# EAGLE design WireToSocket (EAGLE 7.4.0)
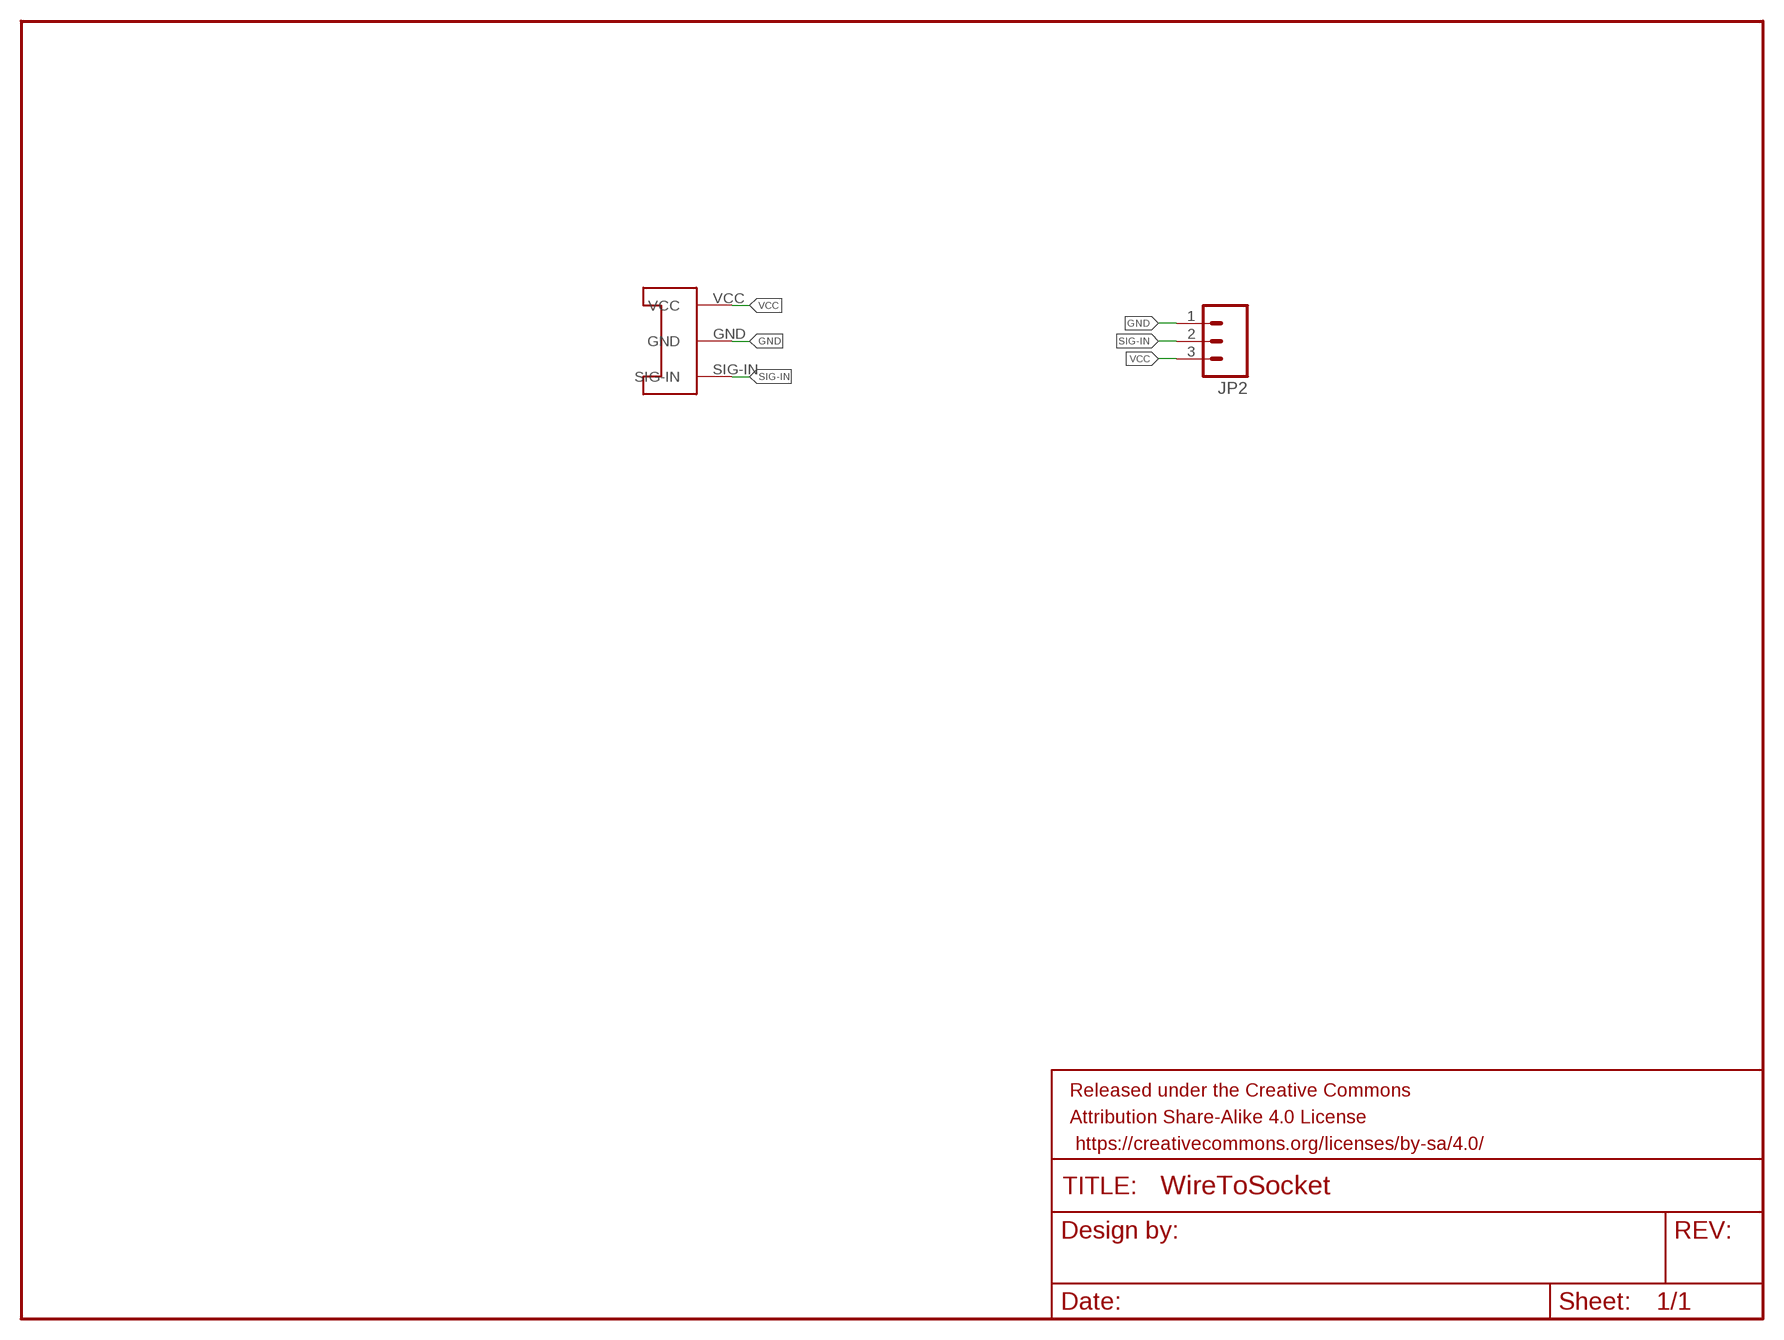
[diagram p0: schematic, sheet 1]

## Parts
FRAME1  FRAME-LETTERNO_PACKAGE  [DUMMY]
JP2  M03SMD  [1X03-1MM-RA]
U$1  CONN-SOCKET-3POS-3MM  [SOCKET-3POS-3MM-SMD]

## Nets
GND: JP2.1 U$1.GND
SIG-IN: JP2.2 U$1.SIG-IN
VCC: JP2.3 U$1.VCC

## Library data of the parts
FRAME1 = SparkFun-Aesthetics:FRAME-LETTER: Schematic Frame Standard 8.5x11 US Letter frame; DESIGNER: Nobody; VERSION: v01
JP2 = SparkFun-Connectors:M03: Header 3 Standard 3-pin 0.1" header. Use with straight break away headers (SKU : PRT-00116), right angle break away headers (PRT-00553), swiss pins (PRT-00743), machine pins (PRT-00117), and female headers (PRT-00115). Molex polarized connector foot print use with SKU : PRT-08232 with associated crimp pins and housings.
U$1 = EmbeddedPlayground:CONN-SOCKET-3POS-3MM: Surface mount board to board connector. Female socket, 3 position.

## Board
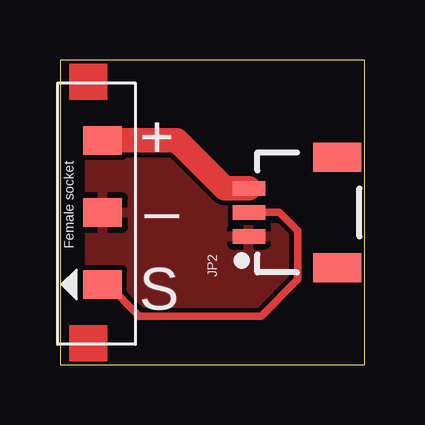
[diagram p1: board, top side]
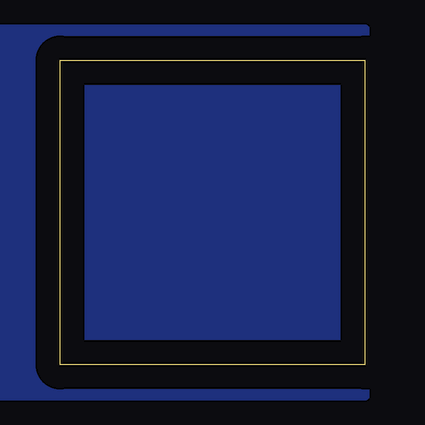
[diagram p2: board, bottom side, seen from below]

Size 12.7 x 12.7 mm. Coordinates in mm from the lower left corner, seen from the top.
Outline: 0,0 12.7,0 12.7,12.7 0,12.7 0,0
Copper layers (1*16): Top 0.035mm / dielectric 1.5mm / Bottom 0.035mm
Design rules "default": minimum track width 10mil, minimum drill 24mil, track to track 8mil, track to pad 8mil, pad to pad 8mil, via to via 8mil, smd to smd 8mil, copper to edge 40mil, drill to drill 8mil, minimum pad ring 10mil, minimum via ring 8mil, stop-mask expansion 4mil, vias tented up to drill 0mil, thermal gap 10mil

### Footprints (pad centres in the part's own frame; a part is rotated, then mirrored left to right if it is on the bottom)
1X03-1MM-RA = smd 0.6 x 1.35: 1 -1,0; 2 0,0; 3 1,0 | smd 1.2 x 2: NC1 2.3,-3.675; NC2 -2.3,-3.675
SOCKET-3POS-3MM-SMD = smd 1.2 x 1.6: GND 0,0; SIG-IN -3,0; VCC 3,0

### Placement (x,y rotation side)
FRAME1  0,0 0 top
JP2  7.87,6.35 90 top
U$1  1.78,6.35 90 top

### Tracks (layer width: path | path; a pad name or v marks a point on that pad's centre or on a via)
GND
  pour Top: 0,13.97 0,-1.27 15.24,-1.27 15.24,13.97
  pour Bottom: 0,13.97 15.24,13.97 15.24,-1.27 0,-1.27
SIG-IN
  Top 0.305: U$1.SIG-IN 1.98,3.35 3.3,2.03 8.38,2.03 9.91,3.56 9.91,5.59 9.14,6.35 JP2.2
VCC
  Top 1.016: U$1.VCC 4.87,9.35 6.86,7.37 7.86,7.37 JP2.3

### Text on the board
tPlace: + | _ | S